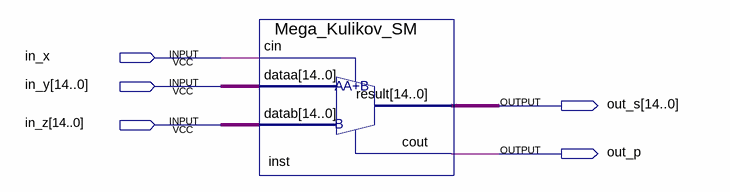
[diagram p0: schematic sheet]
// Quartus schematic Lab2_SM_v3.bdf as structural Verilog: 1 symbols, 5 pins
module Lab2_SM_v3 (
  input  in_x,
  input  [14:0] in_y,
  input  [14:0] in_z,
  output [14:0] out_s,
  output out_p
);

  Mega_Kulikov_SM inst (.cin(in_x), .dataa(in_y), .datab(in_z), .result(out_s), .cout(out_p));
endmodule
